# Altium project 1S_Alchitry_Boost.PrjPcb
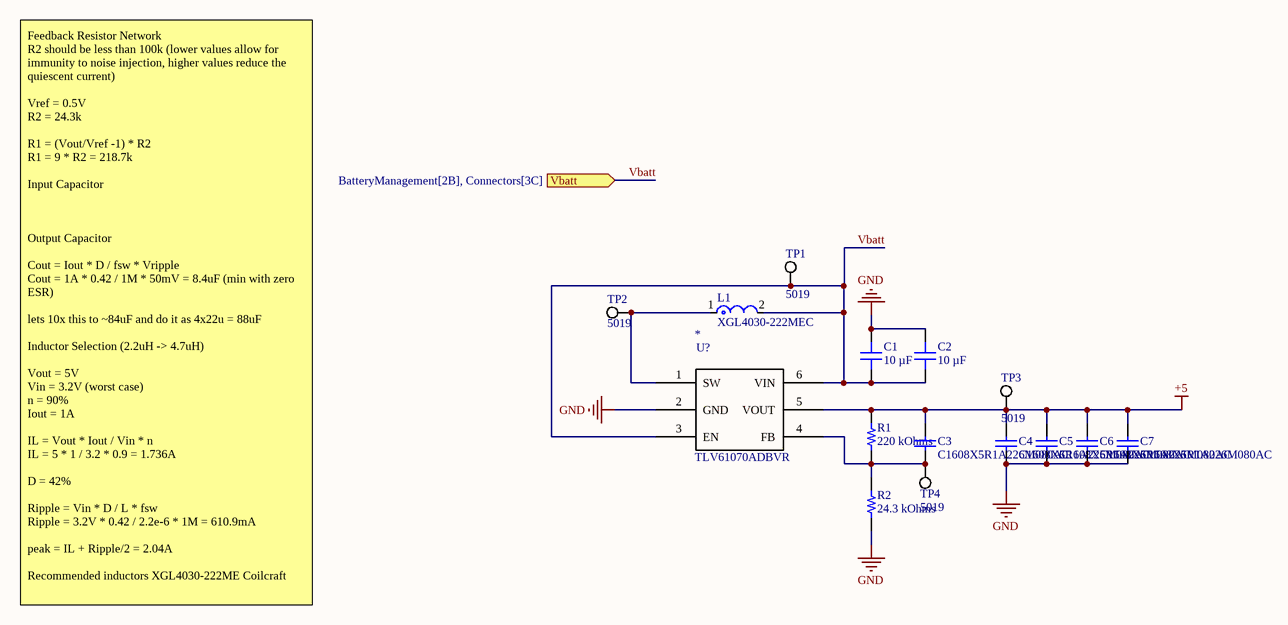
[diagram p0: 5VBoost.SchDoc]
2 sheets, 16 parts. Net scope: flat (ports and power ports of the same name join across sheets).
Board file: BoostBreakoutV1.PcbDoc
Sheets:
  5VBoost.SchDoc
  Connector.SchDoc

## Sheet 5VBoost.SchDoc
size A4; SheetNumber: 1; SheetTotal: 3

### Parts
*  TLV61070ADBVR  [SOT95P280X145-6N]
C1  10 µF  [CAP 0603_1608]
C2  10 µF  [CAP 0603_1608]
C3  C1608X5R1A226M080AC  [CAPC1608X100X20ML10]
C4  C1608X5R1A226M080AC  [CAPC1608X100X20ML10]
C5  C1608X5R1A226M080AC  [CAPC1608X100X20ML10]
C6  C1608X5R1A226M080AC  [CAPC1608X100X20ML10]
C7  C1608X5R1A226M080AC  [CAPC1608X100X20ML10]
L1  XGL4030-222MEC  [FP-XGL4030-MFG]
R1  220 kOhms  [RES 0603_1608]
R2  24.3 kOhms  [RES 0603_1608]
TP1  5019  [KSTN-5019_V]
TP2  5019  [KSTN-5019_V]
TP3  5019  [KSTN-5019_V]
TP4  5019  [KSTN-5019_V]

### Ports
Vbatt (in, see BatteryManagement[2B], Connectors[3C])

### Nets
+5: *.5(VOUT) C3.2 C4.2 C5.2 C6.2 C7.2 R1.2 TP3.1
GND: *.2(GND) C1.2 C2.2 C4.1 C5.1 C6.1 C7.1 R2.1
Vbatt: *.3(EN) *.6(VIN) C1.1 C2.1 L1.2 TP1.1 ; port Vbatt
Net*_1: *.1(SW) L1.1 TP2.1
Net*_4: *.4(FB) C3.1 R1.1 R2.2 TP4.1

### Notes on the sheet
- Feedback Resistor Network
  R2 should be less than 100k (lower values allow for immunity to noise injection, higher values reduce the quiescent current)
  Vref = 0.5V
  R2 = 24.3k
  R1 = (Vout/Vref -1) * R2
  R1 = 9 * R2 = 218.7k
  Input Capacitor
  Output Capacitor
  Cout = Iout * D / fsw * Vripple
  Cout = 1A * 0.42 / 1M * 50mV = 8.4uF (min with zero ESR)
  lets 10x this to ~84uF and do it as 4x22u = 88uF
  Inductor Selection (2.2uH -> 4.7uH)
  Vout = 5V
  Vin = 3.2V (worst case)
  n = 90%
  Iout = 1A
  IL = Vout * Iout / Vin * n
  IL = 5 * 1 / 3.2 * 0.9 = 1.736A
  D = 42%
  Ripple = Vin * D / L * fsw
  Ripple = 3.2V * 0.42 / 2.2e-6 * 1M = 610.9mA
  peak = IL + Ripple/2 = 2.04A
  Recommended inductors XGL4030-222ME Coilcraft
- (in symbol TLV61070ADBVR) U?

### Library data of the parts
C1 C2 = GRM188R61E106KA73J: CAP CER 10UF 25V X5R 0603; manufacturer: Murata Electronics; Tolerance: ±10%; Part Number: GRM188R61E106KA73J; Value: 10 µF; Applications: General Purpose; Capacitance: 10 µF; componentlink1description: Datasheet; componentlink1url: https://search.murata.co.jp/Ceramy/image/img/A01X/G101/ENG/GRM188R61E106KA73-01A.pdf; componentlink2description: DigiKey Link; componentlink2url: https://www.digikey.com/en/products/detail/murata-electronics/GRM188R61E106KA73J/9887674; Device Package: 0603 (1608 Metric); lastupdated: 2023-01-03 8:06:37 PM; Lifecycle Status: Active; Minimum Order: 1; Mounting Type: Surface Mount, MLCC; Operating Temperature: -55°C ~ 85°C; Package / Case: 0603 (1608 Metric); packaging: TapeAndReel; partid: 39529; Part Status: Active; price: 0.04; series: GRM; Size / Dimension: 0.063" L x 0.031" W (1.60mm x 0.80mm); Supplier 1: DigiKey; Supplier Part Number 1: 490-GRM188R61E106KA73JCT-ND; Temperature Coefficient: X5R; Thickness (Max): 0.039" (1.00mm); Voltage - Rated: 25V
C3-C7 = CMP-2000-05441-1: Chip Capacitor, 22 uF, +/- 20%, 10 V, -55 to 85 degC, 0603 (1608 Metric), RoHS, Tape and Reel; Manufacturer: TDK; PCN Part Number: MLCCPartNumberChange30/Nov/2012; Voltage - Rated: 10V; Product Training Modules: CSeriesGeneralApplicationsSEAT,CCV,andTVCLDesignToolsGuidetoReplacinganElectrolyticCapacitorwithanMLCC; Other Names: 445-9077-1; Design Resources: 20WNon-IsolatedBuckLEDDriverUsingPLLNK460KG; Online Catalog: CSeries,GeneralPurpose; Capacitance: 22µF; Temperature Coefficient: X5R; Kits: 445-9014-KIT-ND-KITMLCC100PF-22UF060310-50V; Packaging: CutTape(CT); Standard Package: 1; Package / Case: 0603(1608Metric); Lead Style: -; Features: -; Ratings: -; Operating Temperature: -55degC~85degC; Applications: GeneralPurpose; Package Reference: 603; Datasheet URL: http://download.siliconexpert.com/pdfs/2015/4/21/15/54/45/779/tdk_/manual/37024850441143360mlcc_commercial_general_en.pdf; Datasheet Version: Mar-15; Mounting Type: SurfaceMount,MLCC; Lead Spacing: -; Size / Dimension: 0.063"Lx0.031"W(1.60mmx0.80mm); Height - Seated (Max): -; Package Description: 2-Pin Surface Mount Device, Body 1.6 x 0.8 mm; Manufacturer URL: http://www.tdk.com/; RoHS Information: RoHSCertificate-MLCC; Tolerance: ±20%; Series: C; Thickness (Max): 0.035"(0.90mm); Family: CeramicCapacitors; Category: Capacitors
L1 = CMP-11268-000073-1: Inductor Power Shielded Wirewound 2.2uH 20% 1MHz Composite 8.7A 15mOhm DCR Automotive T/R
R1 = RC0603FR-07220KL: RES 220K OHM 1% 1/10W 0603; Manufacturer: Yageo; Power (Watts): 0.1W, 1/10W; Temperature Coefficient: ±100ppm/°C; Part Number: RC0603FR-07220KL; Value: 220 kOhms; ComponentLink1Description: Datasheet; ComponentLink1URL: https://www.yageo.com/upload/media/product/productsearch/datasheet/rchip/PYu-RC_Group_51_RoHS_L_10.pdf; ComponentLink2Description: DigiKey Link; ComponentLink2URL: https://www.digikey.com/en/products/detail/yageo/RC0603FR-07220KL/727062; Composition: Thick Film; Device Package: 0603 (1608 Metric); Features: Moisture Resistant; Height - Seated (Max): 0.022" (0.55mm); LastUpdated: 2023-01-02 8:29:28 PM; Lifecycle Status: Active; Minimum Order: 1; Number of Terminations: 2; Operating Temperature: -55°C ~ 155°C; Package / Case: 0603 (1608 Metric); Packaging: CutTape; PartId: 19015; Part Status: Active; Price: 0.01; Resistance: 220 kOhms; Series: RC_L; Size / Dimension: 0.063" L x 0.031" W (1.60mm x 0.80mm); Supplier 1: DigiKey; Supplier Part Number 1: 311-220KHRCT-ND; Supplier Device Package: 0603; Tolerance: ±1%
R2 = RC0603FR-0724K3L: RES 24.3K OHM 1% 1/10W 0603; Manufacturer: Yageo; Power (Watts): 0.1W, 1/10W; Temperature Coefficient: ±100ppm/°C; Part Number: RC0603FR-0724K3L; Value: 24.3 kOhms; ComponentLink1Description: Datasheet; ComponentLink1URL: https://www.yageo.com/upload/media/product/productsearch/datasheet/rchip/PYu-RC_Group_51_RoHS_L_10.pdf; ComponentLink2Description: DigiKey Link; ComponentLink2URL: https://www.digikey.com/en/products/detail/yageo/RC0603FR-0724K3L/727078; Composition: Thick Film; Device Package: 0603 (1608 Metric); Features: Moisture Resistant; Height - Seated (Max): 0.022" (0.55mm); LastUpdated: 2023-01-02 8:30:16 PM; Lifecycle Status: Active; Minimum Order: 1; Number of Terminations: 2; Operating Temperature: -55°C ~ 155°C; Package / Case: 0603 (1608 Metric); Packaging: CutTape; PartId: 7644; Part Status: Active; Price: 0.01; Resistance: 24.3 kOhms; Series: RC_L; Size / Dimension: 0.063" L x 0.031" W (1.60mm x 0.80mm); Supplier 1: DigiKey; Supplier Part Number 1: 311-24.3KHRCT-ND; Supplier Device Package: 0603; Tolerance: ±1%
TP1-TP4 = CMP-1672-00008-1: Test Point, 1 Position SMD, RoHS, Tape and Reel; ComponentLink1Description: Manufacturer URL; Package Quantity: 1000; DatasheetVersion: 03/2014; Packaging: Tape and Reel; ComponentLink2URL: http://www.keyelco.com/product-pdf.cfm?p=1357; ComponentLink1URL: http://www.keyelco.com/; Mount: Surface Mount; Contact Plating: Silver; PackageDescription: 1-Pin Surface Mount Device, Body 3.81 x 2.03 mm; Pins: 1; RoHSCompliant: True; Mounting Technology: Surface Mount; ComponentLink2Description: Datasheet; PackageReference: 5019

## Sheet Connector.SchDoc
size A4; SheetNumber: 2; SheetTotal: 2
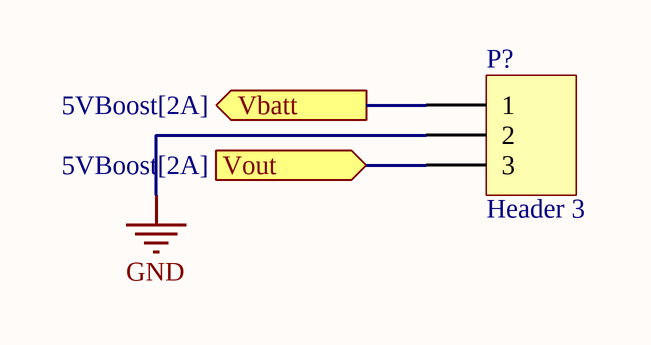
[diagram p1: Connector.SchDoc]

### Parts
P?  Header 3  [HDR1X3]

### Ports
Vbatt (out, see 5VBoost[2A]), Vout (in, see 5VBoost[2A])

### Nets
GND: P?.2
Vbatt: P?.1 ; port Vbatt
NetP?_3: P?.3 ; port Vout

### Library data of the parts
P? = Header 3: Header, 3-Pin; LatestRevisionDate: 17-Jul-2002; LatestRevisionNote: Re-released for DXP Platform.; Publisher: Altium Limited

## Nets that join several sheets
GND: 5VBoost (8 pins), Connector (P?.2)
Vbatt: 5VBoost (6 pins), Connector (P?.1)